# EasyEDA schematic schematic.json
TITLE: Sheet_1; REV: 1.0; Date: 2024-05-19; Sheet: 1/1; Drawn By: mats.rohtmets; Company: Your Company
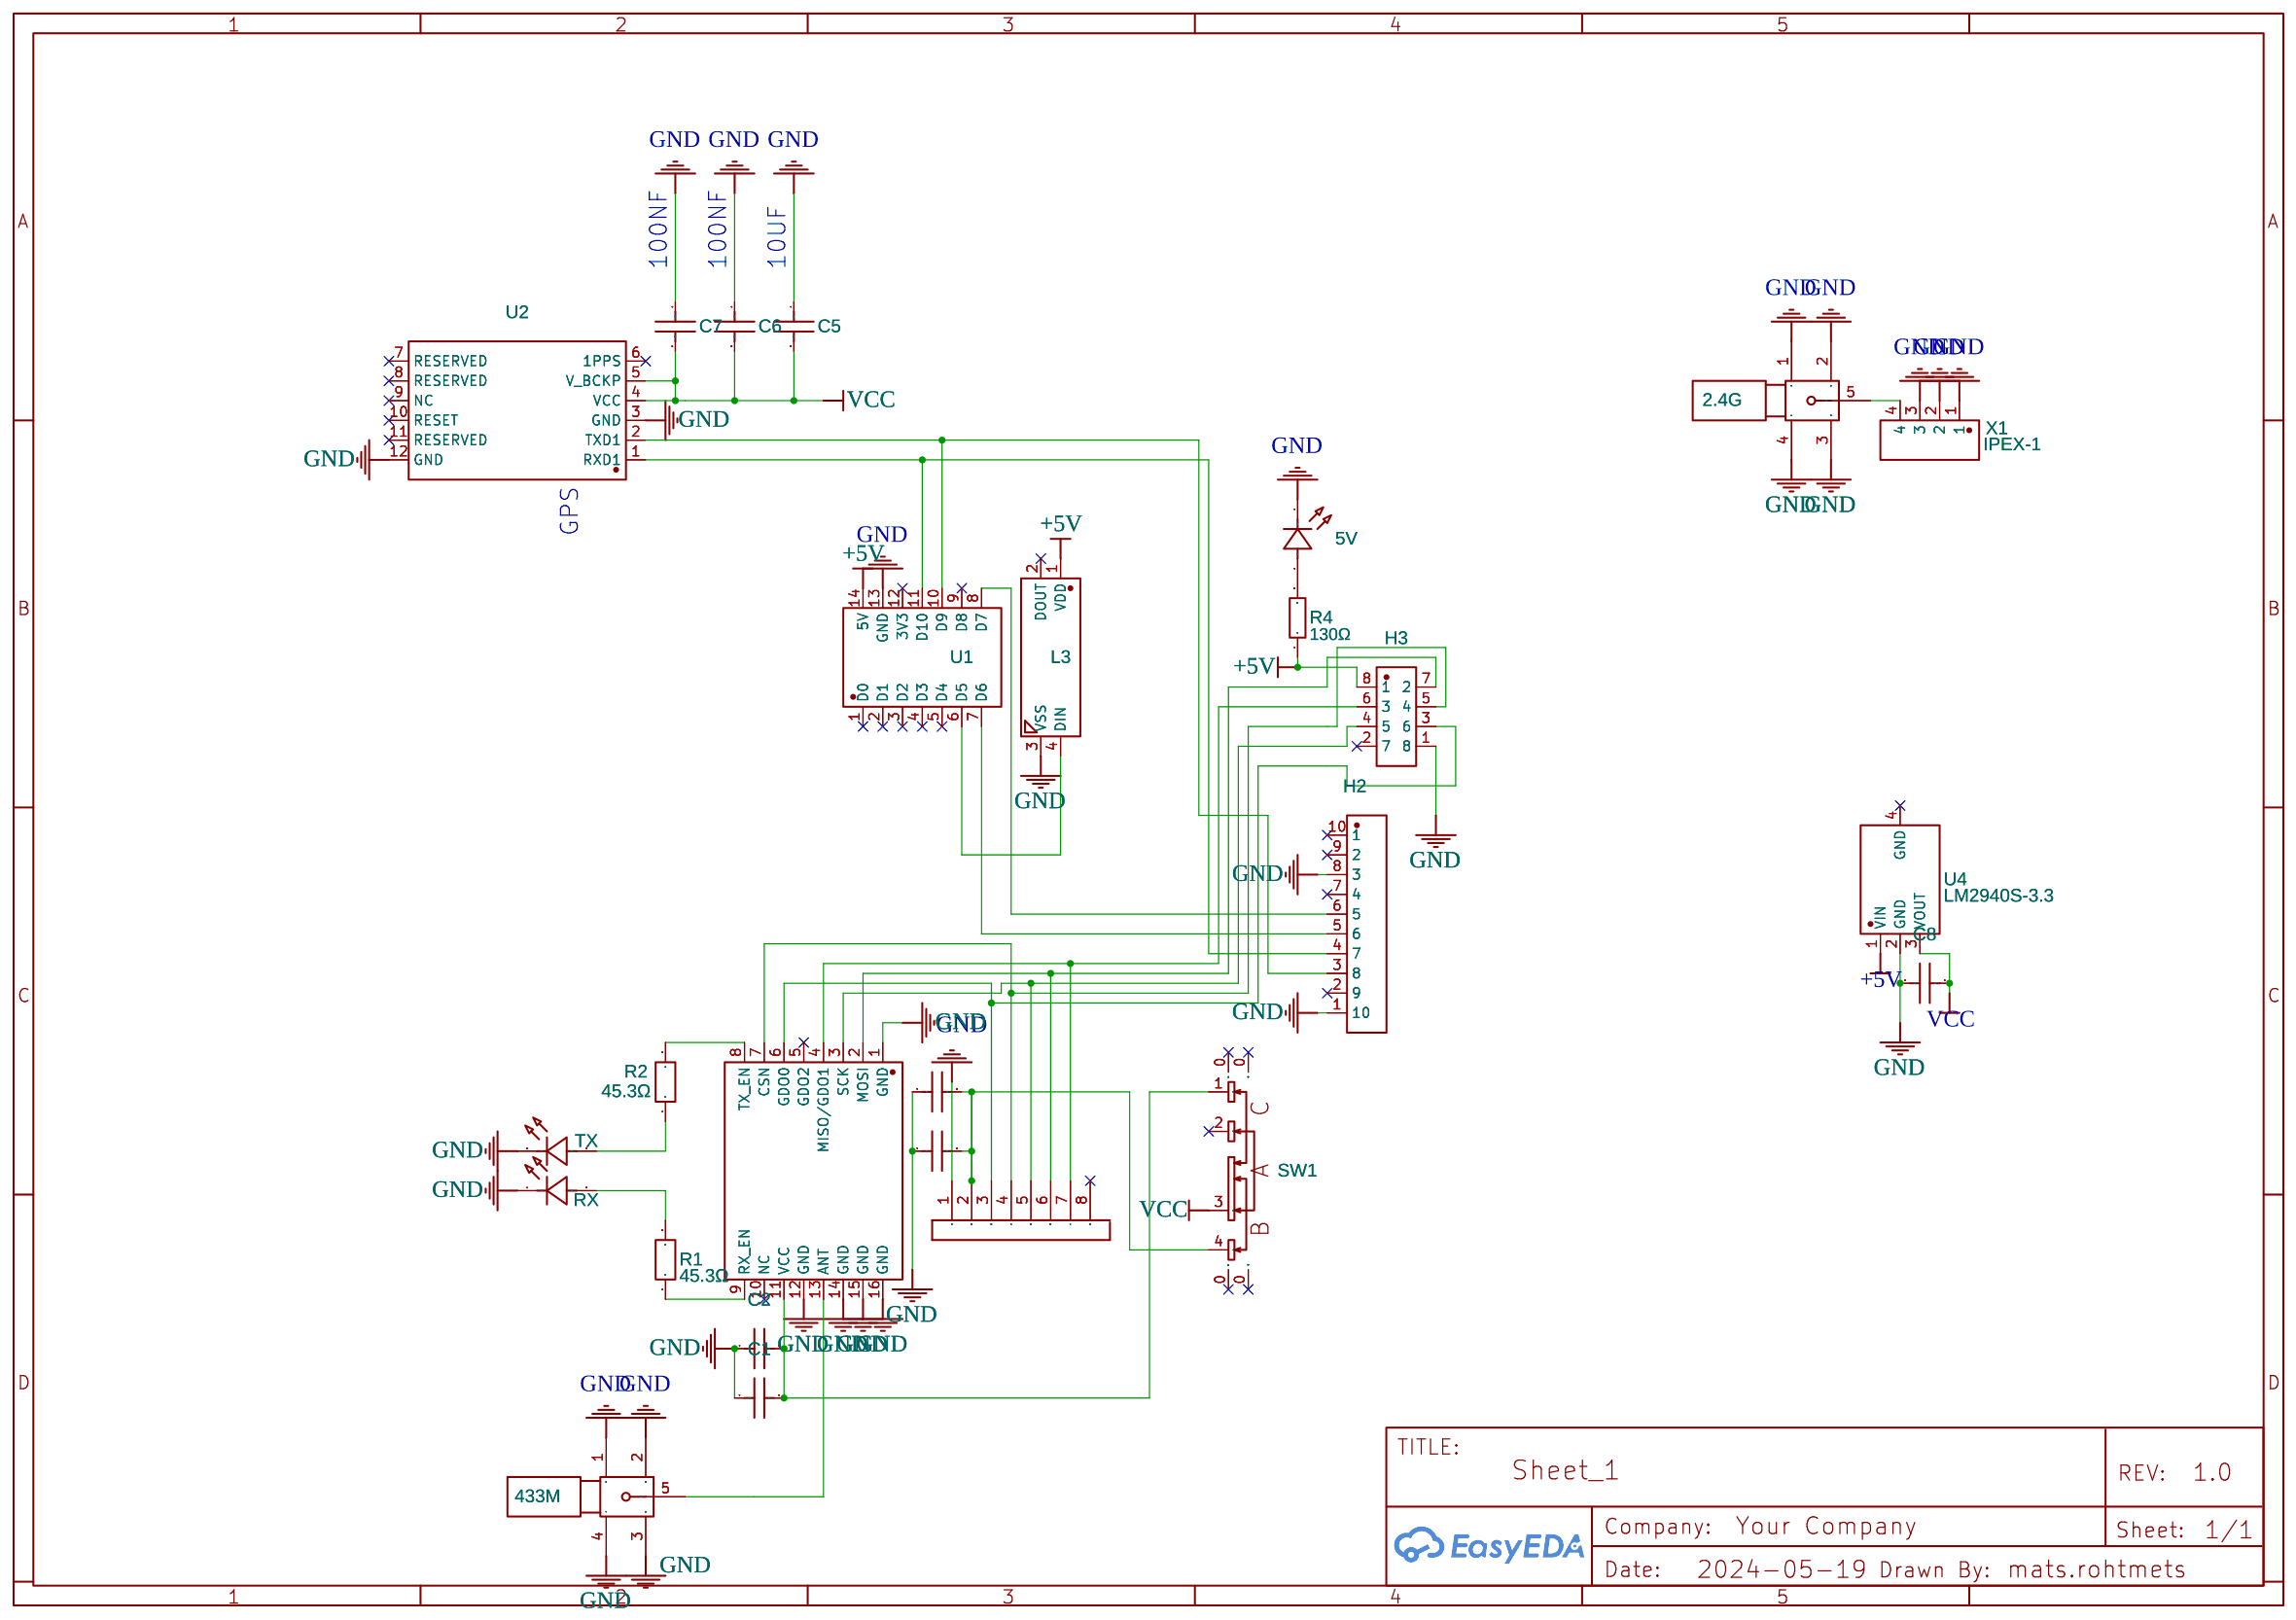
[diagram p0: schematic sheet]

## Parts
2.4G  BWSMA-KE-P001  [SMA-SMD_BWSMA-KE-P001]
5V  XL-3216UYC_C965824  [LED1206-RD_RED]
433M  BWSMA-KE-P001  [SMA-SMD_BWSMA-KE-P001]
C1  10UF  [SMD-0805-CAPACITOR WK]
C2  100NF  [SMD-0805-CAPACITOR WK]
C3  10UF  [SMD-0805-CAPACITOR WK]
C4  100NF  [SMD-0805-CAPACITOR WK]
C5  10UF  [SMD-0805-CAPACITOR WK]
C6  100NF  [SMD-0805-CAPACITOR WK]
C7  100NF  [SMD-0805-CAPACITOR WK]
C8  10UF  [SMD-0805-CAPACITOR WK]
H1  HEADER2X4  [HEADER2X4]
H2  X6511WVS-10H-C60D48R2  [HDR-SMD_10P-P2.54-V-M-LS4.8_R2]
H3  X6511WVS-08H-C60D48R1  [HDR-SMD_8P-P2.54-V-M-LS4.8_XKB_R1]
L3  WS2812E  [LED-SMD_4P-L5.0-W5.0-BL_TC5050RGB]
R1  45.3Ω  [R0603]
R2  45.3Ω  [R0603]
R4  130Ω  [R0603]
RX  XL-3216UYC_C965824  [LED1206-RD_RED]
SW1  TA-3517-A1  [SW-SMD_3P-L9.7-W2.7-P1.50-EH5.0]
TX  XL-3216SURC  [LED1206-R-RD_RED]
U1  XIAO ESP32C3  [COMM-SMD_KQ-2801_V106]
U2  L80RE-M37  [GPSM-SMD_12P-L16.0-W16.0-P2.54-BL]
U3  E07-433M20S  [COMM-SMD_16P-P1.27_E07-433M20S]
U4  LM2940S-3.3  [SOT-223-3_L6.5-W3.4-P2.30-LS7.0-BR]
X1  IPEX-1  [IPEX-SMD_4P-L2.6-W2.6-LS3.0]

## Library data of the parts
2.4G 433M = BWSMA-KE-P001: Contributor: LCSC; Supplier: LCSC; Supplier Part: C496550; Manufacturer: BAT WIRELESS(蝙蝠无线); JLCPCB Part Class: Extended Part
5V = XL-3216UYC_C965824: Supplier: LCSC; Supplier Part: C965824; Manufacturer: XINGLIGHT(成兴光); Manufacturer Part: XL-3216UYC; JLCPCB Part Class: Extended Part; Contributor: lcsc
C1 C3 C5 C8 = KONDENSATOR SMD: Manufacturer Part: CC0805KKX5R6BB106; Supplier Part: C89832; Contributor: cc_CGB; Manufacturer: YAGEO
C2 C4 C6 C7 = KONDENSATOR SMD: Manufacturer Part: 0805B104K101NT; Supplier Part: C89258; Contributor: cc_CGB; Manufacturer: FH (Guangdong Fenghua Advanced Tech)
H1 = HEADER2X4: Contributor: Nathan Milligan
H2 = X6511WVS-10H-C60D48R2: Contributor: LCSC; Supplier: LCSC; Supplier Part: C2883767; Manufacturer: XKB Connection(中国星坤); JLCPCB Part Class: Extended Part
H3 = X6511WVS-08H-C60D48R1: Contributor: LCSC; Supplier: LCSC; Supplier Part: C2883805; Manufacturer: XKB Connection(中国星坤); JLCPCB Part Class: Extended Part
L3 = WS2812E: Contributor: LCSC; Supplier: LCSC; Supplier Part: C139127; Manufacturer: worldsemi; JLCPCB Part Class: Extended Part
R1 R2 = CQ03WAF560JT5E: Contributor: LCSC; Supplier: LCSC; Supplier Part: C101056; Manufacturer: LIZ Elec; Manufacturer Part: CR0603FA45R3G; JLCPCB Part Class: Extended Part
R4 = CR0603-FX-1400ELF: Contributor: LCSC; Supplier: LCSC; Supplier Part: C365079; Manufacturer: RESI; Manufacturer Part: HPCR0603F130RK9; JLCPCB Part Class: Extended Part
RX = XL-3216UYC_C965824: Supplier: LCSC; Supplier Part: C965826; Manufacturer: XINGLIGHT(成兴光); Manufacturer Part: XL-3216SYGC; JLCPCB Part Class: Extended Part; Contributor: lcsc
SW1 = TA-3517-A1: Contributor: LCSC; Supplier: LCSC; Supplier Part: C514001; Manufacturer: Yuandi(元迪); JLCPCB Part Class: Extended Part
TX = XL-3216SURC: Contributor: LCSC; Supplier: LCSC; Supplier Part: C965822; Manufacturer: XINGLIGHT(成兴光); JLCPCB Part Class: Extended Part
U1 = XIAO ESP32C3: Supplier: LCSC; Supplier Part: C19189385; Manufacturer: Seeed studio; JLCPCB Part Class: Extended Part; Contributor: lcsc
U2 = L80RE-M37: Contributor: lcsc; Supplier: LCSC; Supplier Part: C3029061; Manufacturer: Quectel(移远); JLCPCB Part Class: Extended Part
U3 = E07-433M20S: Supplier: LCSC; Supplier Part: C9900082527; Manufacturer: null; JLCPCB Part Class: Extended Part; Contributor: lcsc
U4 = LM2940S-3.3: Contributor: LCSC; Supplier: LCSC; Supplier Part: C596335; Manufacturer: HTC; JLCPCB Part Class: Extended Part
X1 = IPEX-1: Supplier: LCSC; Supplier Part: C2987682; Manufacturer: Ziisor(致哲); Contributor: lcsc; JLCPCB Part Class: Extended Part

## Nets
+5V: H3.8(1) L3.1(VDD) R4.1 U1.14(5V) U4.1(VIN)
GND: 2.4G.1 2.4G.2 2.4G.3 2.4G.4 5V.1(K) 433M.1 433M.2 433M.3 433M.4 C1.1 C2.1 C3.1 C4.1 C5.1 C6.1 C7.1 C8.1 H1.1 H2.1(10) H2.8(3) H3.1(8) L3.3(VSS) RX.1(K) TX.2(A) U1.13(GND) U2.3(GND) U2.12(GND) U3.1(GND) U3.12(GND) U3.14(GND) U3.15(GND) U3.16(GND) U4.2(GND) X1.1 X1.2 X1.3
VCC: C5.2 C6.2 C7.2 C8.2 SW1.3 U2.4(VCC) U2.5(V_BCKP) U4.3(VOUT)
Net-(2.4G-5): 2.4G.5 X1.4
Net-(5V-2): 5V.2(A) R4.2
Net-(433M-5): 433M.5 U3.13(ANT)
Net-(C1-2): C1.2 C2.2 SW1.1 U3.11(VCC)
Net-(C3-2): C3.2 C4.2 H1.2 SW1.4
Net-(H1-3): H1.3 H3.3(6) U3.6(GDO0)
Net-(H1-4): H1.4 H3.5(4) U3.7(CSN)
Net-(H1-5): H1.5 H3.4(5) U3.3(SCK)
Net-(H1-6): H1.6 H3.7(2) U3.2(MOSI)
Net-(H1-7): H1.7 H3.6(3) U3.4(MISO/GDO1)
Net-(H2-3): H2.3(8) U1.10(D9) U2.2(TXD1)
Net-(H2-4): H2.4(7) U1.11(D10) U2.1(RXD1)
Net-(H2-5): H2.5(6) U1.7(D6)
Net-(H2-6): H2.6(5) U1.8(D7)
Net-(L3-4): L3.4(DIN) U1.6(D5)
Net-(R1-1): R1.1 U3.9(RX_EN)
Net-(R1-2): R1.2 RX.2(A)
Net-(R2-1): R2.1 TX.1(K)
Net-(R2-2): R2.2 U3.8(TX_EN)

Not connected (* = marked no-connect by the designer): H1 8*; H2 2(9)* 7(4)* 9(2)* 10(1)*; H3 2(7)*; L3 2(DOUT)*; SW1 0* 2*; U1 1(D0)* 2(D1)* 3(D2)* 4(D3)* 5(D4)* 9(D8)* 12(3V3)*; U2 6(1PPS)* 7(RESERVED)* 8(RESERVED)* 9(NC)* 10(RESET)* 11(RESERVED)*; U3 5(GDO2)* 10(NC)*; U4 4(GND)*

## Notes on the sheet
- 100NF
- 100NF
- 10UF
- GPS
